# Altium project LCLP_DLog_Revisionado.PrjPcb
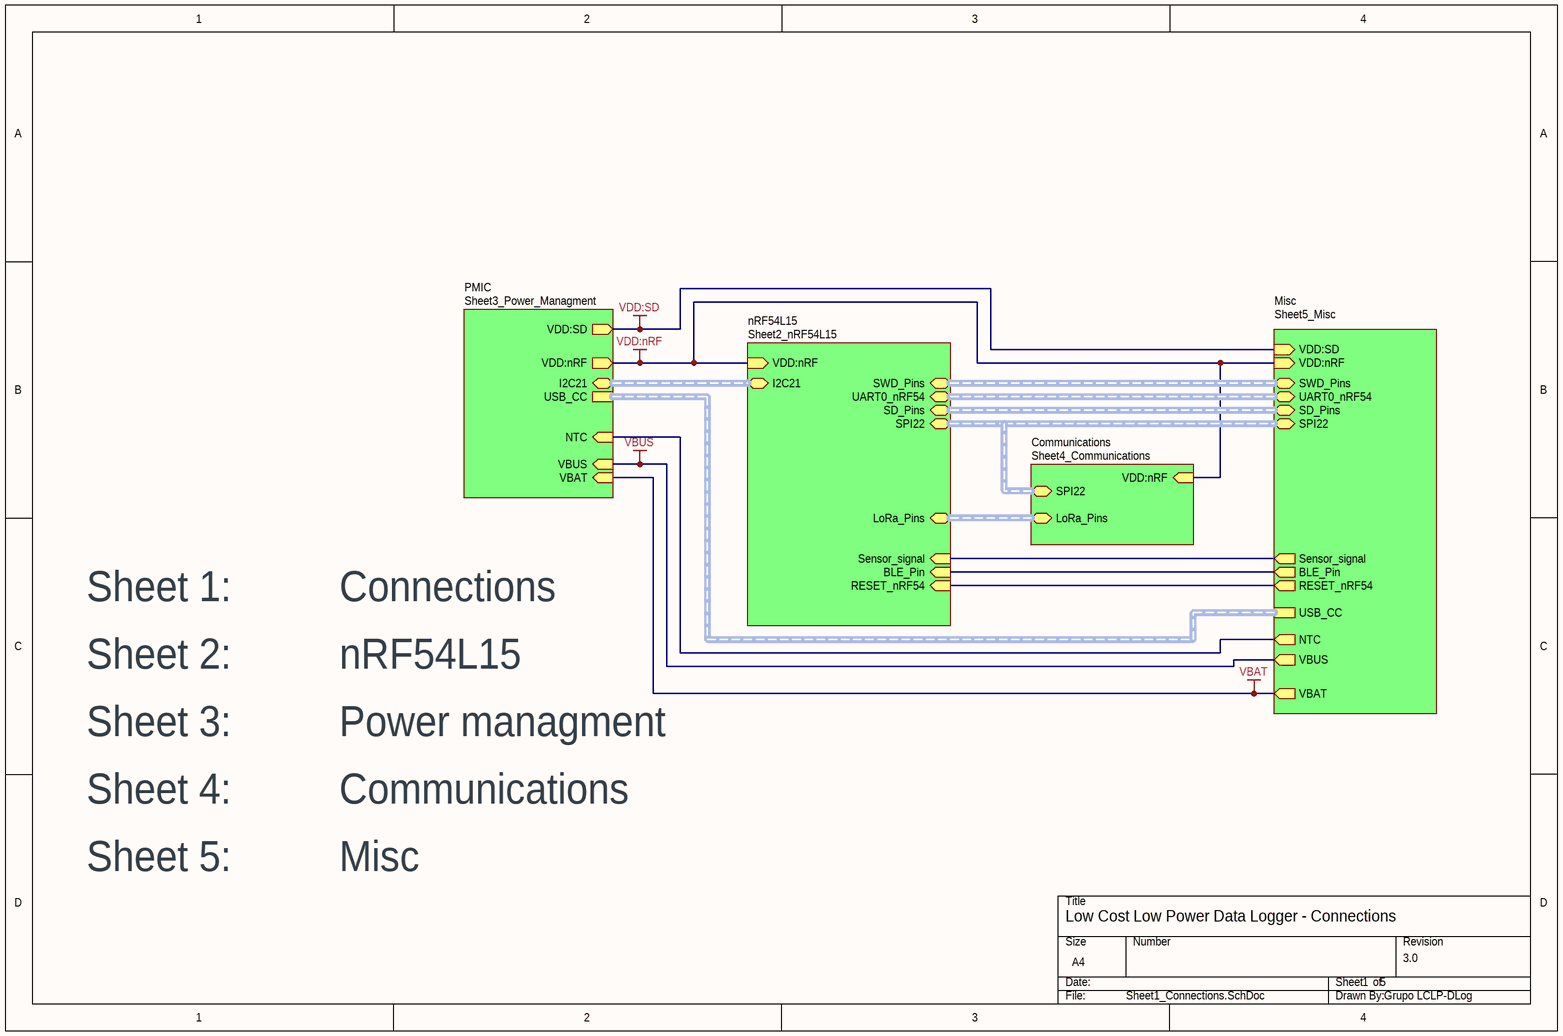
[diagram p0: Sheet1_Connections.SchDoc]
4 sheets, 57 parts. Net scope: hierarchical (ports join the sheet entries above them; power ports are global).
Board file: PCBV2.PcbDoc
Sheets:
  Sheet1_Connections.SchDoc
    nRF54L15 = Sheet2_nRF54L15.SchDoc
    Communications = Sheet4_Communications.SchDoc
    Misc = Sheet5_Misc.SchDoc

## Sheet Sheet1_Connections.SchDoc
size A4; SheetNumber: 1; SheetTotal: 5

### Sub-sheets
Communications = Sheet4_Communications: SPI22 (bidir), LoRa_Pins (bidir), VDD:nRF (in)
Misc = Sheet5_Misc: SWD_Pins (bidir), UART0_nRF54 (bidir), SD_Pins (bidir), RESET_nRF54 (out), SPI22 (bidir), BLE_Pin (out), Sensor_signal (out), USB_CC, NTC (out), VBUS (out), VBAT (out), VDD:nRF (in), VDD:SD (in)
nRF54L15 = Sheet2_nRF54L15: I2C21 (bidir), SPI22 (bidir), LoRa_Pins (bidir), SD_Pins (bidir), UART0_nRF54 (bidir), SWD_Pins (bidir), RESET_nRF54 (in), Sensor_signal (in), BLE_Pin (in), VDD:nRF (in)
PMIC = Sheet3_Power_Managment (file not in this document): I2C21 (bidir), USB_CC, NTC (in), VBUS (in), VBAT (in), VDD:nRF (out), VDD:SD (out)

### Nets
VBAT: sheet PMIC/VBAT, sheet Misc/VBAT
VBUS: sheet PMIC/VBUS, sheet Misc/VBUS
VDD:nRF: sheet nRF54L15/VDD:nRF, sheet PMIC/VDD:nRF, sheet Communications/VDD:nRF, sheet Misc/VDD:nRF
VDD:SD: sheet PMIC/VDD:SD, sheet Misc/VDD:SD
nRF54_RESET: sheet nRF54L15/RESET_nRF54, sheet Misc/RESET_nRF54
P0.04: sheet nRF54L15/Sensor_signal, sheet Misc/Sensor_signal
P1.13: sheet nRF54L15/BLE_Pin, sheet Misc/BLE_Pin
NetP2_2: sheet PMIC/NTC, sheet Misc/NTC

### Buses and harness runs
harness sheet Communications/LoRa_Pins = sheet nRF54L15/LoRa_Pins
harness sheet Communications/SPI22 = sheet Misc/SPI22 = sheet nRF54L15/SPI22
harness sheet Misc/SD_Pins = sheet nRF54L15/SD_Pins
harness sheet Misc/SWD_Pins = sheet nRF54L15/SWD_Pins
harness sheet Misc/UART0_nRF54 = sheet nRF54L15/UART0_nRF54
harness sheet Misc/USB_CC = sheet PMIC/USB_CC
harness sheet nRF54L15/I2C21 = sheet PMIC/I2C21

### Notes on the sheet
- Sheet 1:          Connections
- Sheet 2:          nRF54L15
- Sheet 3:          Power managment
- Sheet 4:          Communications
- Sheet 5:          Misc
- Low Cost Low Power Data Logger - Connections
- 1
- 5
- 3.0
- Grupo LCLP-DLog

## Sheet Sheet2_nRF54L15.SchDoc
size A4; SheetNumber: 2; SheetTotal: 5
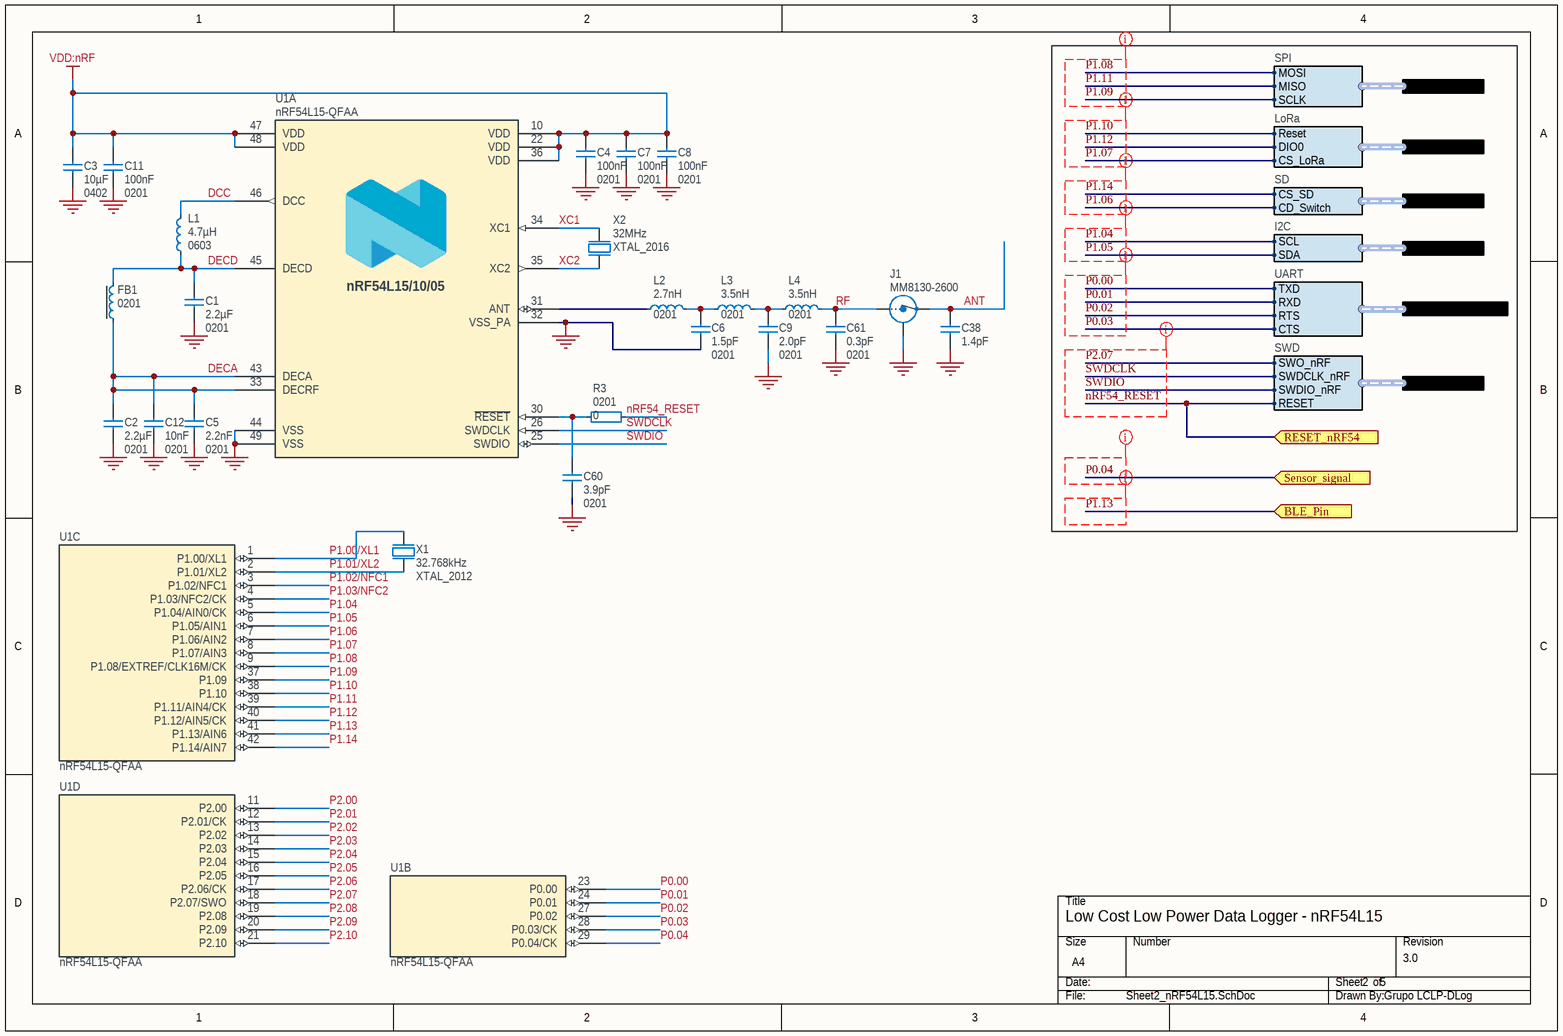
[diagram p1: Sheet2_nRF54L15.SchDoc]

### Parts
C1  2.2µF  Footprint Doc: 0201  [CAPC0603X03L_C]
C2  2.2µF  Footprint Doc: 0201  [CAPC0603X03L_C]
C3  10µF  Footprint Doc: 0402  [CAPC1005X04L]
C4  100nF  Footprint Doc: 0201  [CAPC0603X03L_C]
C5  2.2nF  Footprint Doc: 0201  [CAPC0603X03L_C]
C6  1.5pF  Footprint Doc: 0201  [CAPC0603X03L_C]
C7  100nF  Footprint Doc: 0201  [CAPC0603X03L_C]
C8  100nF  Footprint Doc: 0201  [CAPC0603X03L_C]
C9  2.0pF  Footprint Doc: 0201  [CAPC0603X03L_C]
C11  100nF  Footprint Doc: 0201  [CAPC0603X03L_C]
C12  10nF  Footprint Doc: 0201  [CAPC0603X03L_C]
C38  1.4pF  [CAPC0603X03L_C]
C60  3.9pF  Footprint Doc: 0201  [CAPC0603X03L_C]
C61  0.3pF  Footprint Doc: 0201  [CAPC0603X03L_C]
FB1  Footprint Doc: 0201  [INDC0603X03L_C]  (hidden comment: 120R/0.2A)
J1  MM8130-2600  [COAXIAL-SWF]
L1  4.7µH  Footprint Doc: 0603  [INDC1608X06L]
L2  2.7nH  Footprint Doc: 0201  [INDC0603X03L_C]
L3  3.5nH  Footprint Doc: 0201  [INDC0603X03L_C]
L4  3.5nH  Footprint Doc: 0201  [INDC0603X03L_C]
R3  0  Footprint Doc: 0201  [RESC0603X03L_C]
U1  nRF54L15-QFAA  [QFN40P600X600X90-48N]  (parts A,B,C,D of 4)
X1  32.768kHz  [XTAL_2012]
X2  32MHz  Footprint Doc: XTAL_2016  [BT-XTAL_2016]

### Ports
BLE_Pin (in, see Sheet1_Connections[3C], Sheet5_Misc[1C]), I2C21 (harness I2C, see Sheet1_Connections[2B], Sheet3_Power_Managment[1C]), LoRa_Pins (harness LoRa, see Sheet1_Connections[3C], Sheet4_Communications[1B]), RESET_nRF54 (in, see Sheet1_Connections[3C], Sheet5_Misc[1C]), SD_Pins (harness SD, see Sheet1_Connections[3B], Sheet5_Misc[2B]), Sensor_signal (in, see Sheet1_Connections[3C], Sheet5_Misc[1D]), SPI22 (harness SPI, see Sheet1_Connections[3B], Sheet4_Communications[1B], Sheet5_Misc[2A]), SWD_Pins (harness SWD, see Sheet1_Connections[3B], Sheet5_Misc[3A]), UART0_nRF54 (harness UART, see Sheet1_Connections[3B], Sheet5_Misc[2C])

### Harnesses
SPI: MISO, MOSI, SCLK
LoRa: DIO0, Reset, CS_LoRa
SD: CD_Switch, CS_SD
UART: RXD, TXD, RTS, CTS
I2C: SDA, SCL
SWD: SWDIO_nRF, SWDCLK_nRF, SWO_nRF, RESET

### Nets
GND: C1.1 C2.1 C3.1 C4.2 C5.1 C6.1 C7.2 C8.2 C9.1 C11.2 C12.1 C38.1 C60.1 C61.1 J1.2(Shield) U1.32(VSS_PA) U1.44(VSS) U1.49(VSS) X2.2(GND) X2.4(GND)
VDD:nRF: C3.2 C4.1 C7.1 C8.1 C11.1 U1.10(VDD) U1.22(VDD) U1.36(VDD) U1.47(VDD) U1.48(VDD)
ANT: C38.2 J1.3(OUT)
DCC: L1.1 U1.46(DCC)
DECA: C2.2 C5.2 C12.2 FB1.2 U1.33(DECRF) U1.43(DECA)
DECD: C1.2 FB1.1 L1.2 U1.45(DECD)
nRF54_RESET: R3.2 ; port RESET_nRF54, port SWD_Pins.RESET
P0.00: U1.23(P0.00) ; port UART0_nRF54.TXD
P0.01: U1.24(P0.01) ; port UART0_nRF54.RXD
P0.02: U1.27(P0.02) ; port UART0_nRF54.RTS
P0.03: U1.28(P0.03/CK) ; port UART0_nRF54.CTS
P0.04: U1.29(P0.04/CK) ; port Sensor_signal
P1.00/XL1: U1.1(P1.00/XL1) X1.2(out)
P1.01/XL2: U1.2(P1.01/XL2) X1.1(inp)
P1.02/NFC1: U1.3(P1.02/NFC1)
P1.03/NFC2: U1.4(P1.03/NFC2/CK)
P1.04: U1.5(P1.04/AIN0/CK) ; port I2C21.SCL
P1.05: U1.6(P1.05/AIN1) ; port I2C21.SDA
P1.06: U1.7(P1.06/AIN2) ; port SD_Pins.CD_Switch
P1.07: U1.8(P1.07/AIN3) ; port LoRa_Pins.CS_LoRa
P1.08: U1.9(P1.08/EXTREF/CLK16M/CK) ; port SPI22.MOSI
P1.09: U1.37(P1.09) ; port SPI22.SCLK
P1.10: U1.38(P1.10) ; port LoRa_Pins.Reset
P1.11: U1.39(P1.11/AIN4/CK) ; port SPI22.MISO
P1.12: U1.40(P1.12/AIN5/CK) ; port LoRa_Pins.DIO0  [project net DIO0_LoRa]
P1.13: U1.41(P1.13/AIN6) ; port BLE_Pin
P1.14: U1.42(P1.14/AIN7) ; port SD_Pins.CS_SD
P2.00: U1.11(P2.00)
P2.01: U1.12(P2.01/CK)
P2.02: U1.13(P2.02)
P2.03: U1.14(P2.03)
P2.04: U1.15(P2.04)
P2.05: U1.16(P2.05)
P2.06: U1.17(P2.06/CK)
P2.07: U1.18(P2.07/SWO) ; port SWD_Pins.SWO_nRF
P2.08: U1.19(P2.08)
P2.09: U1.20(P2.09)
P2.10: U1.21(P2.10)
RF: C61.2 J1.1(IN) L4.2
SWDCLK: U1.26(SWDCLK) ; port SWD_Pins.SWDCLK_nRF
SWDIO: U1.25(SWDIO) ; port SWD_Pins.SWDIO_nRF
XC1: U1.34(XC1) X2.1(inp)
XC2: U1.35(XC2) X2.3(out)
NetC6_2: C6.2 L2.2 L3.1
NetC9_2: C9.2 L3.2 L4.1
NetC60_2: C60.2 R3.1 U1.30(~{RESET})
NetL2_1: L2.1 U1.31(ANT)

### Layout directives
net class BUTTONS: nRF54_RESET, P0.00, P0.01, P0.02, P0.03, P0.04, P1.04, P1.05, P1.06, P1.07, P1.08, P1.09, P1.10, P1.11, P1.12, P1.13, P1.14, P2.07, SWDCLK, SWDIO

### Notes on the sheet
- Low Cost Low Power Data Logger - nRF54L15
- 2
- 5
- 3.0
- Grupo LCLP-DLog
- (in symbol nRF54L15-QFAAC00, part A) nRF54L15/10/05

### Library data of the parts
C1 C2 = C0201-2µ2-2.5V-X6T-GRM033D80E225ME47D: Capacitor, Ceramic, 2.2µF 2.5V X6T 0201,±20%; Manufacturer: Murata; Manufacturer Part Number: GRM033R61A225KE47; Part number NEMS: 100200527; Component Status: Active; Pad Count: 2; Note: 2.5V, 20%, X6T; Artikkelnr Noca: N.A.; Part Number: C0201-2µ2-2.5V-X6T-GRM033D80E225ME47D; Component Class: Capacitors; Author: stl1; ComponentLink1URL: https://www.murata.com/products/productdetail?partno=GRM033D80E225ME47%23; ComponentLink1Description: Datasheet; ComponentLink2URL: N.A.; ComponentLink2Description: Supplier link; HelpURL: N.A.; LatestRevisionDate: 2022-02-27; Published: 2022-02-27; Value: 2.2µF; Supplier 1: Mouser; Supplier Part Number 1: 81-GRM033D80E225ME7D; Supplier 2: Digi-Key; Supplier Part Number 2: 490-18653-1-ND; Part number IPS: N.A.; Part number Norautron: N.A.; PartId: 100200527
C3 = C0402-10µF-6.3V-X6S: Capacitor, X6S, ±20%, 6.3V; Manufacturer: N.A.; Part number NEMS: 100200478; Component Status: Active; Pad Count: 2; Part Number: C0402-10µF-6.3V-X6S; PartId: 100200478; Component Class: Capacitors; Author: getr; Manufacturer Part Number: N.A.; ComponentLink1URL: N.A.; ComponentLink1Description: Datasheet; ComponentLink2URL: N.A.; ComponentLink2Description: Supplier link; HelpURL: N.A.; LatestRevisionDate: 2021-06-25; Published: 2021-06-25; Value: 10µF; Note: 6.3V; Supplier 1: N.A.; Supplier Part Number 1: N.A.; Supplier 2: N.A.; Supplier Part Number 2: N.A.; Artikkelnr Noca: N.A.; Part number IPS: N.A.; Part number Norautron: N.A.
C4 C7 C8 C11 = C0201-100n-10V-X7R: Capacitor, X7R, ±10%; Manufacturer: N.A.; Part number NEMS: 100200469; Note: 10V; Pad Count: 2; Component Status: Active; Part Number: C0201-100n-10V-X7R; Manufacturer Part Number: N.A.; LatestRevisionDate: 2021-04-12; Published: 2021-04-12; Value: 100nF; Artikkelnr Noca: N.A.; Part number IPS: N.A.; ComponentLink1URL: N.A.; ComponentLink1Description: Datasheet; ComponentLink2URL: N.A.; ComponentLink2Description: Supplier link; HelpURL: N.A.; Supplier 1: N.A.; Supplier Part Number 1: N.A.; Supplier 2: N.A.; Supplier Part Number 2: N.A.; Component Class: Capacitors; Author: getr; Part number Norautron: N.A.; PartId: 100200469
C5 = C0201-2n2: Capacitor, X7R, ±10%, 10V; Manufacturer: N.A.; Part number IPS: 00000001778; Part number Norautron: 26470002; Part number NEMS: 100200060; Component Status: Active; Pad Count: 2; Part Number: C0201-2n2; PartId: 100200060; Component Class: Capacitors; Author: rsk; Manufacturer Part Number: N.A.; ComponentLink1URL: N.A.; ComponentLink1Description: Datasheet; ComponentLink2URL: N.A.; ComponentLink2Description: Supplier link; HelpURL: N.A.; LatestRevisionDate: 2014-11-13; Published: 2014-11-13; Value: 2.2nF; Note: 10V; Supplier 1: N.A.; Supplier Part Number 1: N.A.; Supplier 2: N.A.; Supplier Part Number 2: N.A.; Artikkelnr Noca: N.A.
C6 = C0201-1.5p-25V-NP0-GJM0335C1E1R5WB01: Capacitor, NP0, ±0.05pF, 25V, High Q; Manufacturer: Murata; Part number NEMS: 100200477; Component Status: Active; Pad Count: 2; Artikkelnr Noca: N.A.; Part Number: C0201-1.5p-25V-NP0-GJM0335C1E1R5WB01; PartId: 100200477; Component Class: Capacitors; Author: masi; Manufacturer Part Number: GJM0335C1E1R5WB01; ComponentLink1URL: https://search.murata.co.jp/Ceramy/image/img/A01X/G101/ENG/GJM0335C1E1R5WB01-01.pdf; ComponentLink1Description: Datasheet; ComponentLink2URL: N.A.; ComponentLink2Description: Supplier link; HelpURL: https://www.murata.com/products/productdetail?partno=GJM0335C1E1R5WB01%23; LatestRevisionDate: 2021-06-15; Published: 2021-06-15; Value: 1.5pF; Note: 25V; Supplier 1: Digi-Key; Supplier Part Number 1: 490-11176-2-ND; Supplier 2: Mouser; Supplier Part Number 2: 81-GJM0335C1E1R5WB1D; Part number IPS: N.A.; Part number Norautron: N.A.
C9 = C0201-2.0p-HQ-Murata: Capacitor, NP0, ±0.05pF, 25V; Manufacturer: Murata; Manufacturer Part Number: GJM0335C1E2R0WB01; Part number IPS: 00000001775; Part number NEMS: 100200419; Component Status: Active; Pad Count: 2; Artikkelnr Noca: N.A.; Part Number: C0201-2.0p-HQ-Murata; PartId: 100200419; Component Class: Capacitors; Author: rsk; ComponentLink1URL: N.A.; ComponentLink1Description: Datasheet; ComponentLink2URL: N.A.; ComponentLink2Description: Supplier link; HelpURL: https://psearch.en.murata.com/capacitor/product/GJM0335C1E2R0WB01%23.html; LatestRevisionDate: 2018-10-25; Published: 2018-10-25; Value: 2.0pF; Note: 25V; Supplier 1: N.A.; Supplier Part Number 1: N.A.; Supplier 2: N.A.; Supplier Part Number 2: N.A.; Part number Norautron: N.A.
C12 = C0201-10n-6.3V-X7R: Capacitor, X7R, 6.3V; Manufacturer: Murata; Manufacturer Part Number: GRM033R70J103KA01D; Part number NEMS: 100200407; Component Status: Active; Pad Count: 2; Artikkelnr Noca: N.A.; Part Number: C0201-10n-6.3V-X7R; PartId: 100200407; Component Class: Capacitors; Author: rsk; ComponentLink1URL: http://search.murata.co.jp/Ceramy/image/img/A01X/G101/ENG/GRM033R70J103KA01-01.pdf; ComponentLink1Description: Datasheet; ComponentLink2URL: N.A.; ComponentLink2Description: Supplier link; HelpURL: N.A.; LatestRevisionDate: 2020-10-13; Published: 2018-05-07; Value: 10nF; Note: 6.3V; Supplier 1: Digi-Key; Supplier Part Number 1: 490-1262-1-ND; Supplier 2: N.A.; Supplier Part Number 2: N.A.; Part number IPS: N.A.; Part number Norautron: N.A.
C38 = C0201-1.4p-25V-GJM0335C1E1R4WB01D: Capacitor, C0G, ±0.05pF, 25V; Manufacturer: Murata; Part number NEMS: 100200553; Pad Count: 2; Artikkelnr Noca: N.A.; Component Status: Active; Part Number: C0201-1.4p-25V-GJM0335C1E1R4WB01D; PartId: 100200553; Component Class: Capacitors; Author: stl1; Manufacturer Part Number: GJM0335C1E1R4WB01D; ComponentLink1URL: https://www.murata.com/products/productdetail?partno=GJM0335C1E1R4WB01%23; ComponentLink1Description: Datasheet; ComponentLink2URL: N.A.; ComponentLink2Description: Supplier link; HelpURL: N.A.; Footprint Doc: 0201; LatestRevisionDate: 2023-05-30; Published: 2023-05-30; Value: 1.4pF; Note: 25V; Supplier 1: Digi-Key; Supplier Part Number 1: 490-GJM0335C1E1R4WB01DTR-ND; Supplier 2: Mouser; Supplier Part Number 2: 81-GJM0335C1E1R4WB1D; Part number IPS: N.A.; Part number Norautron: N.A.
C60 = C0201-3.9p: Chip Cap 0201; Manufacturer: N.A.; Part number NEMS: 100200024; Component Status: Active; Pad Count: 2; Note: Chip Cap 1%; Part Number: C0201-3.9p; PartId: 100200024; Component Class: Capacitors; Author: rsk; Manufacturer Part Number: N.A.; ComponentLink1URL: N.A.; ComponentLink1Description: Datasheet; ComponentLink2URL: N.A.; ComponentLink2Description: Supplier link; HelpURL: N.A.; LatestRevisionDate: 2014-11-13; Published: 2014-11-13; Value: 3.9pF; Supplier 1: N.A.; Supplier Part Number 1: N.A.; Supplier 2: N.A.; Supplier Part Number 2: N.A.; Artikkelnr Noca: N.A.; Part number IPS: N.A.; Part number Norautron: N.A.
C61 = C0201-0.3p-50V-GRM0335C1HR30BA01: Capacitor, C0G, ±0.1pF, 50V; Manufacturer: Murata; Part number NEMS: 100200650; Component Status: Active; Pad Count: 2; Artikkelnr Noca: N.A.; Part Number: C0201-0.3p-50V-GRM0335C1HR30BA01; PartId: 100200650; Component Class: Capacitors; Author: masi; Manufacturer Part Number: GRM0335C1HR30BA01; ComponentLink1URL: https://www.murata.com/en-global/products/productdetail?partno=GRM0335C1HR30BA01%23; ComponentLink1Description: Datasheet; ComponentLink2URL: N.A.; ComponentLink2Description: Supplier link; HelpURL: N.A.; LatestRevisionDate: 2024-01-10; Published: 2024-01-10; Value: 0.3pF; Note: 50V; Supplier 1: Digi-Key; Supplier Part Number 1: 490-6135-2-ND; Supplier 2: Mouser; Supplier Part Number 2: 81-GRM0335C1HR30BA1D; Part number IPS: N.A.; Part number Norautron: N.A.
FB1 = FB0201-120R@100M-200mA-BLM03AG121SN1D: Ferrite Bead, 120 Ohm @ 100MHz, 200mA, 500 mOhm Max; Manufacturer: Murata; Part number NEMS: 100300419; Component Status: Active; Pad Count: 2; Artikkelnr Noca: N.A.; Part Number: FB0201-120R@100M-200mA-BLM03AG121SN1D; Component Class: Inductors; Author: stl1; Manufacturer Part Number: BLM03AG121SN1D; ComponentLink1URL: https://www.murata.com/en-eu/products/productdetail?partno=BLM03AG121SN1%23; ComponentLink1Description: Datasheet; ComponentLink2URL: N.A.; ComponentLink2Description: Supplier link; HelpURL: N.A.; LatestRevisionDate: 2022-02-27; Published: 2022-02-27; Value: 120R/0.2A; Note: Ferrite Bead; Supplier 1: Digi-Key; Supplier Part Number 1: 490-5622-1-ND; Supplier 2: Mouser; Supplier Part Number 2: 81-BLM03AX121SN1D; Part number IPS: N.A.; Part number Norautron: N.A.; PartId: 100300419
J1 = MM8130-2600: Coaxial Connector with Switch; Manufacturer: Murata; Part number IPS: 00000009955; Part number Norautron: 26030338; Part number NEMS: 100500400; Component Status: Active; Pad Count: 3; Note: N.A.; Artikkelnr Noca: 55029011; Part Number: MM8130-2600; PartId: 100500400; Component Class: Connectors; Author: rsk; Manufacturer Part Number: MM8130-2600; ComponentLink1URL: N.A.; ComponentLink1Description: Datasheet; ComponentLink2URL: N.A.; ComponentLink2Description: Supplier link; HelpURL: http://www.murata.com/products/catalog/pdf/o33e.pdf; LatestRevisionDate: 2014-04-24; Published: 2014-04-24; Footprint Doc: COAXIAL-SWF; Value: MM8130-2600; Supplier 1: Digi-Key; Supplier Part Number 1: 490-4981-1-ND; Supplier 2: Mouser; Supplier Part Number 2: 81-MM8130-2600RA2; System: Connector
L1 = L0603-4µ7-MLZ1608M4R7WT000: Inductor, 120mA, ±20%, 0.65R; Manufacturer: TDK Corporation; Part number NEMS: 100300440; Component Status: Active; Pad Count: 2; Note: Power Inductor ±20%; Artikkelnr Noca: N.A.; Part Number: L0603-4µ7-MLZ1608M4R7WT000; PartId: 100300440; Component Class: Inductors; Author: stl1; Manufacturer Part Number: MLZ1608M4R7WT000; ComponentLink1URL: https://product.tdk.com/en/search/inductor/inductor/smd/info?part_no=MLZ1608M4R7WT000; ComponentLink1Description: Datasheet; ComponentLink2URL: N.A.; ComponentLink2Description: Supplier link; HelpURL: N.A.; LatestRevisionDate: 2023-05-10; Published: 2023-05-10; Value: 4.7µH; Supplier 1: Digi-Key; Supplier Part Number 1: 445-6390-2-ND; Supplier 2: Mouser; Supplier Part Number 2: 810-MLZ1608M4R7WT000; Part number IPS: N.A.; Part number Norautron: N.A.
L2 = L0201-2n7-HQ-Murata: Inductor, 600mA, ±0.1ｎH, 120mOhm; Manufacturer: Murata; Manufacturer Part Number: LQP03HQ2N7B02; Part number IPS: 00000001753; Part number NEMS: 100300214; Component Status: Active; Pad Count: 2; Note: -55°C ~ 125°C; Artikkelnr Noca: N.A.; Part Number: L0201-2n7-HQ-Murata; PartId: 100300214; Component Class: Inductors; Author: rsk; ComponentLink1URL: https://search.murata.co.jp/Ceramy/image/img/P02/JELF243C-0021.pdf; ComponentLink1Description: Datasheet; ComponentLink2URL: N.A.; ComponentLink2Description: Supplier link; HelpURL: https://psearch.en.murata.com/inductor/product/LQP03HQ2N7B02%23.html; LatestRevisionDate: 2018-10-23; Published: 2018-10-23; Value: 2.7nH; Supplier 1: Digi-Key; Supplier Part Number 1: 490-13909-1-ND; Supplier 2: N.A.; Supplier Part Number 2: N.A.; Part number Norautron: N.A.
L3 L4 = L0201-3n5-HQ-Murata: Inductor, 500mA, ±0.1ｎH, 170mOhm; Manufacturer: Murata; Manufacturer Part Number: LQP03HQ3N5B02; Part number NEMS: 100300222; Component Status: Active; Pad Count: 2; Note: -55°C ~ 125°C; Artikkelnr Noca: N.A.; Part Number: L0201-3n5-HQ-Murata; PartId: 100300222; Component Class: Inductors; Author: rsk; ComponentLink1URL: https://search.murata.co.jp/Ceramy/image/img/P02/JELF243C-0021.pdf; ComponentLink1Description: Datasheet; ComponentLink2URL: N.A.; ComponentLink2Description: Supplier link; HelpURL: https://psearch.en.murata.com/inductor/product/LQP03HQ3N5B02%23.html; LatestRevisionDate: 2018-10-23; Published: 2018-10-23; Value: 3.5nH; Supplier 1: Digi-Key; Supplier Part Number 1: 490-13925-1-ND; Supplier 2: N.A.; Supplier Part Number 2: N.A.; Part number IPS: N.A.; Part number Norautron: N.A.
R3 = R0201-1k0: Resistor, ±1%, 0.05W; Manufacturer: N.A.; Part number IPS: 00000005786; Part number NEMS: 100100043; Component Status: Active; Pad Count: 2; Value: 1k; Note: Chip Res 1%; Part Number: R0201-1k0; PartId: 100100043; Component Class: Resistors; Author: rsk; Manufacturer Part Number: N.A.; ComponentLink1URL: N.A.; ComponentLink1Description: Datasheet; ComponentLink2URL: N.A.; ComponentLink2Description: Supplier link; HelpURL: N.A.; LatestRevisionDate: 2014-11-13; Published: 2014-11-13; Supplier 1: N.A.; Supplier Part Number 1: N.A.; Supplier 2: N.A.; Supplier Part Number 2: N.A.; Artikkelnr Noca: N.A.; Part number Norautron: N.A.
U1 = nRF54L15-QFAAC00: Multi-protocol Bluetooth Low Energy, IEEE 802.15.4 and 2.4GHz proprietary Wireless MCU; Manufacturer: Nordic Semiconductor; Part number NEMS: 102000382; Component Status: Active; Pad Count: 49; Note: N.A.; Part Number: nRF54L15-QFAAC00; Component Class: Nordic_Devices; Author: stl1; Manufacturer Part Number: nRF54L15-QFAAC00; ComponentLink1URL: N.A.; ComponentLink1Description: Datasheet; ComponentLink2URL: N.A.; ComponentLink2Description: Supplier link; HelpURL: N.A.; LatestRevisionDate: 2025-01-30; Published: 2025-01-30; Footprint Doc: QFN-48; Value: nRF54L15-QFAA; Supplier 1: Nordic Semiconductor; Supplier Part Number 1: nRF54L15-QFAAC00; Supplier 2: N.A.; Supplier Part Number 2: N.A.; Artikkelnr Noca: N.A.; Part number IPS: N.A.; Part number Norautron: N.A.; PartId: 102000382
X1 = XTAL_SMD2012_32.768kHz_9pF_TXC: XTAL SMD 2012, 32.768kHz, 9pF, ±20ppm; Manufacturer: TXC Corporation; Manufacturer Part Number: 9HT11-32.768KDZC-T; Part number NEMS: 101600107; Component Status: Active; Pad Count: 2; Note: XTAL SMD 32.768kHz; Artikkelnr Noca: N.A.; Part Number: XTAL_SMD2012_32.768kHz_9pF_TXC; PartId: 101600107; Component Class: Oscillators; Author: eisk; ComponentLink1URL: http://www.txccrystal.com/images/pdf/9ht11.pdf; ComponentLink1Description: Datasheet; ComponentLink2URL: https://www.digikey.com/en/products/detail/9HT11-32.768KDZC-T/887-1426-1-ND/2403277; ComponentLink2Description: Supplier link; HelpURL: http://www.txccrystal.com/images/pdf/9ht11.pdf; LatestRevisionDate: 2023-03-14; Published: 2014-03-28; Footprint Doc: XTAL_2012; Value: 32.768kHz; Supplier 1: Digi-Key; Supplier Part Number 1: 887-1426-2-ND; Supplier 2: Mouser; Supplier Part Number 2: 717-9HT11-32.7KDZC-T; Part number IPS: N.A.; Part number Norautron: N.A.
X2 = XTAL_SMD2016_32MHz_8pF_Kyocera: XTAL SMD 2016, 32MHz, Cl=8pF, Tot: ±40ppm; Manufacturer Part Number: CX2016DB32000D0WZRC1; Part number IPS: 00000007827; Part number Norautron: 26511136; Part number NEMS: 101600039; Component Status: Active; Pad Count: 4; Note: XTAL SMD 32.000MHz; Artikkelnr Noca: 22010022; Part Number: XTAL_SMD2016_32MHz_8pF_Kyocera; PartId: 101600039; Component Class: Oscillators; Author: rsk; Manufacturer: Kyocera; ComponentLink1URL: N.A.; ComponentLink1Description: Datasheet; ComponentLink2URL: N.A.; ComponentLink2Description: Supplier link; HelpURL: http://media.digikey.com/pdf/Data%20Sheets/AVX%20PDFs/CX2016DB32000D0WZRC1_Spec.pdf; LatestRevisionDate: 2016-06-02; Published: 2015-10-15; Value: 32MHz; Supplier 1: Digi-Key; Supplier Part Number 1: 1253-1586-1-ND; Supplier 2: N.A.; Supplier Part Number 2: N.A.

## Sheet Sheet4_Communications.SchDoc
size A4; SheetNumber: 4; SheetTotal: 5
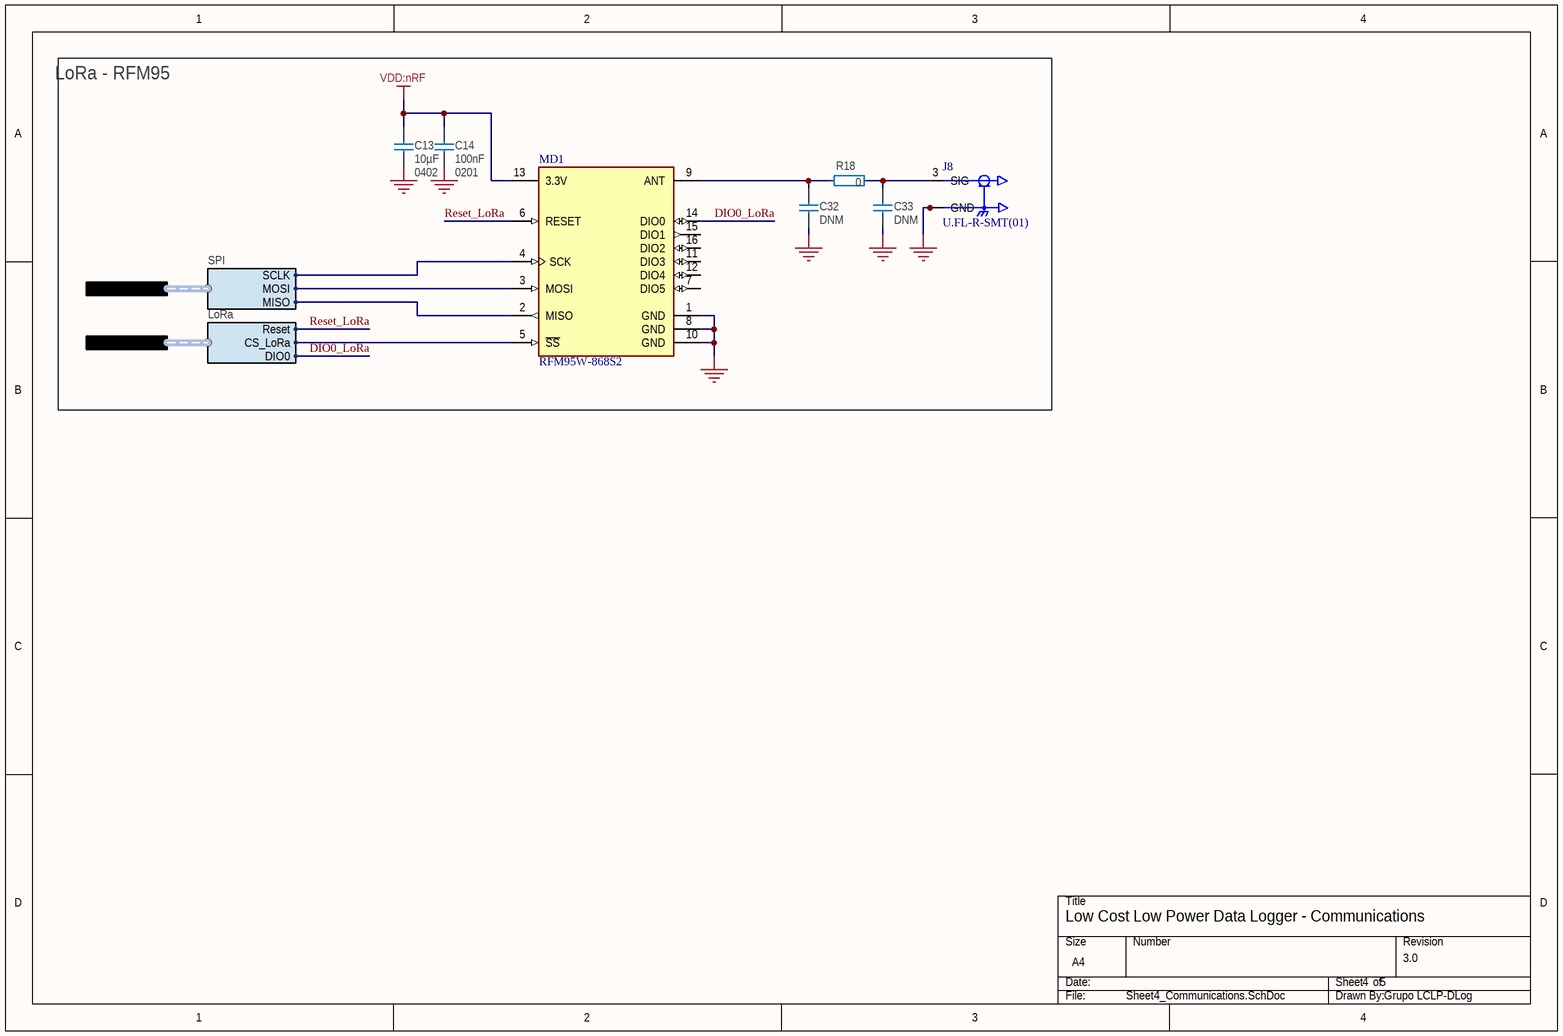
[diagram p2: Sheet4_Communications.SchDoc]

### Parts
C13  10µF  Footprint Doc: 0402  [CAPC1005X04L]
C14  100nF  Footprint Doc: 0201  [CAPC0603X03L_C]
C32  DNM  [CAPC1005X04L_DNM]
C33  DNM  [CAPC1005X04L_DNM]
J8  U.FL-R-SMT(01)  [HRS_U.FL-R-SMT(01)]
MD1  RFM95W-868S2  [FP-RFM95W-868S2-MFG]
R18  0  [RESC1005X04L]

### Blocks framed on the sheet
LoRa - RFM95: C13 C14 C32 C33 J8 MD1 R18

### Ports
LoRa_Pins (harness LoRa, see Sheet1_Connections[3C], Sheet2_nRF54L15[4A]), SPI22 (harness SPI, see Sheet1_Connections[3B], Sheet2_nRF54L15[4A], Sheet5_Misc[2A])

### Harnesses
SPI: MISO, MOSI, SCLK
LoRa: DIO0, Reset, CS_LoRa

### Nets
GND: C13.1 C14.2 C32.1 C33.1 J8.1(GND) J8.2(GND) MD1.1(GND) MD1.8(GND) MD1.10(GND)
VDD:nRF: C13.2 C14.1 MD1.13(3.3V)
DIO0_LoRa: MD1.14(DIO0) ; port LoRa_Pins.DIO0
P1.07: MD1.5(~{SS}) ; port LoRa_Pins.CS_LoRa
P1.08: MD1.3(MOSI) ; port SPI22.MOSI
P1.09: MD1.4(SCK) ; port SPI22.SCLK
P1.11: MD1.2(MISO) ; port SPI22.MISO
Reset_LoRa: MD1.6(RESET) ; port LoRa_Pins.Reset  [project net P1.10]
NetC32_2: C32.2 MD1.9(ANT) R18.2
NetC33_2: C33.2 J8.3(SIG) R18.1

Not connected (* = marked no-connect by the designer): MD1 7(DIO5) 11(DIO3) 12(DIO4) 15(DIO1) 16(DIO2)

### Notes on the sheet
- Low Cost Low Power Data Logger - Communications
- 4
- 5
- 3.0
- Grupo LCLP-DLog

### Library data of the parts
C13 = C0402-10µF-6.3V-X6S: as C3 on sheet Sheet2_nRF54L15; Part Number: C0402-10µF-6.3V-X6S; PartId: 100200478; Component Class: Capacitors; Author: getr; Manufacturer Part Number: N.A.; ComponentLink1URL: N.A.; ComponentLink1Description: Datasheet; ComponentLink2URL: N.A.; ComponentLink2Description: Supplier link; HelpURL: N.A.; LatestRevisionDate: 2021-06-25; Published: 2021-06-25; Value: 10µF; Note: 6.3V; Supplier 1: N.A.; Supplier Part Number 1: N.A.; Supplier 2: N.A.; Supplier Part Number 2: N.A.; Artikkelnr Noca: N.A.; Part number IPS: N.A.; Part number Norautron: N.A.
C14 = C0201-100n-10V-X7R: as C4 on sheet Sheet2_nRF54L15; Part Number: C0201-100n-10V-X7R; Manufacturer Part Number: N.A.; LatestRevisionDate: 2021-04-12; Published: 2021-04-12; Value: 100nF; Artikkelnr Noca: N.A.; Part number IPS: N.A.; ComponentLink1URL: N.A.; ComponentLink1Description: Datasheet; ComponentLink2URL: N.A.; ComponentLink2Description: Supplier link; HelpURL: N.A.; Supplier 1: N.A.; Supplier Part Number 1: N.A.; Supplier 2: N.A.; Supplier Part Number 2: N.A.; Component Class: Capacitors; Author: getr; Part number Norautron: N.A.; PartId: 100200469
C32 C33 = C0402-2µ2-10V: Capacitor, X5R, ±10%; Manufacturer: N.A.; Part number NEMS: 100200376; Component Status: Active; Pad Count: 2; Value: 2.2µF; Note: 10V; Part Number: C0402-2µ2-10V; PartId: 100200376; Component Class: Capacitors; Author: rsk; Manufacturer Part Number: N.A.; ComponentLink1URL: N.A.; ComponentLink1Description: Datasheet; ComponentLink2URL: N.A.; ComponentLink2Description: Supplier link; HelpURL: N.A.; LatestRevisionDate: 2020-10-13; Published: 2016-08-22; Footprint Doc: 0402; Supplier 1: Digi-Key; Supplier Part Number 1: 490-10451-1-ND; Supplier 2: N.A.; Supplier Part Number 2: N.A.; Artikkelnr Noca: N.A.; Part number IPS: N.A.; Part number Norautron: N.A.
J8 = CMP-002-00098-1: U.FL (UMCC) Connector Receptacle, Male Pin 50Ohm Surface Mount Solder. RF Connectors / Coaxial Connectors; MF: Hirose; Purchase-URL: https://pricing.snapeda.com/search/part/U.FL-R-SMT(01)/?ref=eda; Pins: 3; Check_prices: https://www.snapeda.com/parts/U.FL-R-SMT(01)/Hirose+Electric+Co+Ltd/view-part/?ref=eda; Case/Package: None; Design Item ID: U.FL-R-SMT(01); Price: None; Value: *; Component Type: Standard; Availability: In Stock; Source: U.FL-R-SMT(01).SchLib; MP: U.FL-R-SMT(01); SnapEDA_Link: https://www.snapeda.com/parts/U.FL-R-SMT(01)/Hirose+Electric+Co+Ltd/view-part/?ref=snap
MD1 = CMP-00000-1: RFM95W LoRA Transceiver Module 868MHz; Sensitivity (dBm): -123dBm; Min Supply Voltage: 1.8V; Max Junction Temperature (Tj): 125°C; Number of GPIO: 6; Interface: SPI; Data Rate: 300kbps; Nominal Supply Current: 5.8mA; Max Supply Voltage: 3.7V; Current - Receiving: 13.8mA; Current - Transmitting: 120mA; Frequency: 868MHz; Case/Package: SMD/SMT; Height: 1.8mm; Min Operating Temperature: -20°C; Mounting Technology: Surface Mount; Clock Frequency: 868MHz; RoHS: Compliant; Max Operating Temperature: 70°C
R18 = R0201-1k0: as R3 on sheet Sheet2_nRF54L15; Part Number: R0201-1k0; PartId: 100100043; Component Class: Resistors; Author: rsk; Manufacturer Part Number: N.A.; ComponentLink1URL: N.A.; ComponentLink1Description: Datasheet; ComponentLink2URL: N.A.; ComponentLink2Description: Supplier link; HelpURL: N.A.; LatestRevisionDate: 2014-11-13; Published: 2014-11-13; Supplier 1: N.A.; Supplier Part Number 1: N.A.; Supplier 2: N.A.; Supplier Part Number 2: N.A.; Artikkelnr Noca: N.A.; Part number Norautron: N.A.

## Sheet Sheet5_Misc.SchDoc
size A4; SheetNumber: 5; SheetTotal: 5
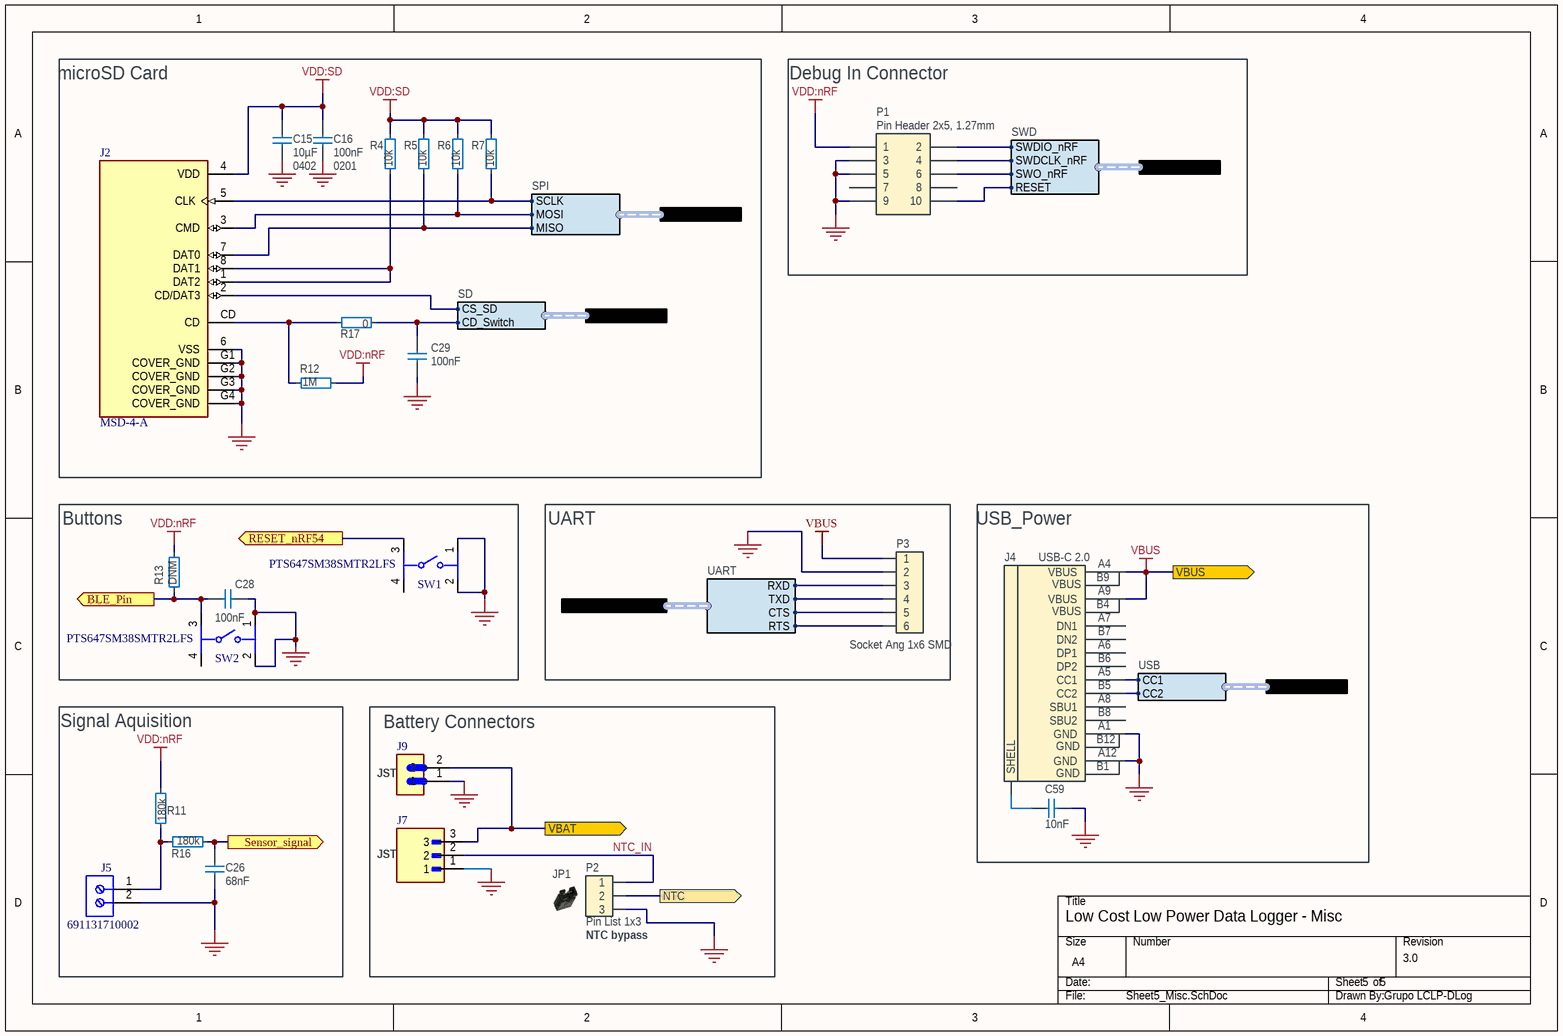
[diagram p3: Sheet5_Misc.SchDoc]

### Parts
C15  10µF  Footprint Doc: 0402  [CAPC1005X04L]
C16  100nF  Footprint Doc: 0201  [CAPC0603X03L_C]
C26  68nF  [CAPC1608X06L]
C28  100nF  [CAPC1608X06L]
C29  100nF  [CAPC1608X06L]
C59  10nF  [CAPC1608X06L]
J2  MSD-4-A  [CUI_MSD-4-A]
J4  USB-C 2.0  [SD-80259-001]
J5  691131710002  [691131710002]
J7  S3B-ZR-SM4A-TF  [JST_S3B-ZR-SM4A-TF]  (value not drawn)
J9  S2B-ZR-SM4A-TF  [JST_S2B-ZR-SM4A-TF]  (value not drawn)
JP1  Shunt 2.54mm  [Shunt_2.54mm_Vertical]  (value not drawn)
P1  Pin Header 2x5, 1.27mm  [HDR_2x5-SMD-1.27mm-K]
P2  Pin List 1x3  [LIST_1x3_SMD]
P3  Socket Ang 1x6 SMD  [SOCKET_1x6_SMD-ANG]
R4  10k  [RESC0603X03L_C]
R5  10k  [RESC0603X03L_C]
R6  10k  [RESC0603X03L_C]
R7  10k  [RESC0603X03L_C]
R11  180k  [RESC1005X04L]
R12  1M  [RESC1005X04L]
R13  DNM  [RESC1005X04L_NC]
R16  180k  [RESC1005X04L]
R17  0  [RESC1005X04L]
SW1  PTS647SM38SMTR2LFS  [FP-PTS647SM38SMTR2LFS-MFG]
SW2  PTS647SM38SMTR2LFS  [FP-PTS647SM38SMTR2LFS-MFG]

### Blocks framed on the sheet
microSD Card: C15 C16 C29 J2 R4-R7 R12 R17
Debug In Connector: P1
Buttons: C28 R13 SW1 SW2
UART: P3
USB_Power: C59 J4
Signal Aquisition: C26 J5 R11 R16
Battery Connectors: J7 J9 JP1 P2

### Ports
BLE_Pin (out, see Sheet1_Connections[4C], Sheet2_nRF54L15[4B]), NTC (out, see Sheet1_Connections[4C], Sheet3_Power_Managment[1B]), RESET_nRF54 (out, see Sheet1_Connections[4C], Sheet2_nRF54L15[4B]), SD_Pins (harness SD, see Sheet1_Connections[4B], Sheet2_nRF54L15[4A]), Sensor_signal (out, see Sheet1_Connections[4C], Sheet2_nRF54L15[4B]), SPI22 (harness SPI, see Sheet1_Connections[4B], Sheet2_nRF54L15[4A], Sheet4_Communications[1B]), SWD_Pins (harness SWD, see Sheet1_Connections[4B], Sheet2_nRF54L15[4B]), UART0_nRF54 (harness UART, see Sheet1_Connections[4B], Sheet2_nRF54L15[4B]), USB_CC (harness USB, see Sheet1_Connections[4C], Sheet3_Power_Managment[1A]), VBAT (out, see Sheet1_Connections[4C], Sheet3_Power_Managment[1B]), VBUS (out, see Sheet1_Connections[4C], Sheet3_Power_Managment[1A])

### Harnesses
SD: CS_SD, CD_Switch
UART: RXD, TXD, RTS, CTS
SPI: MISO, MOSI, SCLK
SWD: SWDIO_nRF, SWDCLK_nRF, SWO_nRF, RESET
USB: CC2, CC1

### Nets
GND: C15.1 C16.2 C26.1 C28.1 C29.1 C59.2 J2.6(VSS) J2.G1(COVER_GND) J2.G2(COVER_GND) J2.G3(COVER_GND) J2.G4(COVER_GND) J4.A1(GND) J4.A12(GND) J5.2 J7.1 J9.1 P1.3 P1.5 P1.9 P2.3 P3.2 SW1.1 SW1.2 SW2.1 SW2.2
VBAT: J7.3 J9.2 ; port VBAT
VBUS: J4.A4(VBUS) J4.A9(VBUS) P3.1 ; port VBUS
VDD:nRF: P1.1 R11.2 R12.2 R13.2
VDD:SD: C15.2 C16.1 J2.4(VDD) R4.1 R5.1 R6.1 R7.1
nRF54_RESET: P1.10 SW1.3 ; port RESET_nRF54, port SWD_Pins.RESET
NTC_IN: J7.2 P2.1
P0.00: P3.4 ; port UART0_nRF54.TXD
P0.01: P3.3 ; port UART0_nRF54.RXD
P0.02: P3.6 ; port UART0_nRF54.RTS
P0.03: P3.5 ; port UART0_nRF54.CTS
P0.04: C26.2 R16.1 ; port Sensor_signal
P1.06: C29.2 R17.1 ; port SD_Pins.CD_Switch
P1.08: J2.3(CMD) R6.2 ; port SPI22.MOSI
P1.09: J2.5(CLK) R7.2 ; port SPI22.SCLK
P1.11: J2.7(DAT0) R5.2 ; port SPI22.MISO
P1.13: C28.2 R13.1 SW2.3 ; port BLE_Pin
P1.14: J2.2(CD/DAT3) ; port SD_Pins.CS_SD
P2.07: P1.6 ; port SWD_Pins.SWO_nRF
SWDCLK: P1.4 ; port SWD_Pins.SWDCLK_nRF
SWDIO: P1.2 ; port SWD_Pins.SWDIO_nRF
NetC59_1: C59.1 J4.SHLD(SHELL)
NetJ2_1: J2.1(DAT2) J2.8(DAT1) R4.2
NetJ2_CD: J2.CD R12.1 R17.2
NetJ4_A5: J4.A5(CC1) ; port USB_CC.CC1
NetJ4_B5: J4.B5(CC2) ; port USB_CC.CC2
NetJ5_1: J5.1 R11.1 R16.2
NetP2_2: P2.2 ; port NTC

Not connected (* = marked no-connect by the designer): J4 A6(DP1) A7(DN1) A8(SBU1) B6(DP2) B7(DN2) B8(SBU2); P1 7 8; SW1 4; SW2 4

### Notes on the sheet
- (near J9) JST
- (near J7) JST
- Low Cost Low Power Data Logger - Misc
- (near P2) NTC bypass
- 5
- 3.0
- Grupo LCLP-DLog
- (in symbol SD-80259-1021) B9; B4; B12; B1

### Library data of the parts
C15 = C0402-10µF-6.3V-X6S: as C3 on sheet Sheet2_nRF54L15; Part Number: C0402-10µF-6.3V-X6S; PartId: 100200478; Component Class: Capacitors; Author: getr; Manufacturer Part Number: N.A.; ComponentLink1URL: N.A.; ComponentLink1Description: Datasheet; ComponentLink2URL: N.A.; ComponentLink2Description: Supplier link; HelpURL: N.A.; LatestRevisionDate: 2021-06-25; Published: 2021-06-25; Value: 10µF; Note: 6.3V; Supplier 1: N.A.; Supplier Part Number 1: N.A.; Supplier 2: N.A.; Supplier Part Number 2: N.A.; Artikkelnr Noca: N.A.; Part number IPS: N.A.; Part number Norautron: N.A.
C16 = C0201-100n-10V-X7R: as C4 on sheet Sheet2_nRF54L15; Part Number: C0201-100n-10V-X7R; Manufacturer Part Number: N.A.; LatestRevisionDate: 2021-04-12; Published: 2021-04-12; Value: 100nF; Artikkelnr Noca: N.A.; Part number IPS: N.A.; ComponentLink1URL: N.A.; ComponentLink1Description: Datasheet; ComponentLink2URL: N.A.; ComponentLink2Description: Supplier link; HelpURL: N.A.; Supplier 1: N.A.; Supplier Part Number 1: N.A.; Supplier 2: N.A.; Supplier Part Number 2: N.A.; Component Class: Capacitors; Author: getr; Part number Norautron: N.A.; PartId: 100200469
C26 C28 C29 = C0603-10µ: Capacitor, X5R, ±20%; Manufacturer: N.A.; Part number IPS: 00000007785; Part number NEMS: 100200275; Value: 10µF; Note: 6.3V; Artikkelnr Noca: 20039234; Pad Count: 2; Component Status: Active; Part Number: C0603-10µ; Manufacturer Part Number: N.A.; ComponentLink1URL: N.A.; ComponentLink1Description: Datasheet; ComponentLink2URL: N.A.; ComponentLink2Description: Supplier link; HelpURL: N.A.; Footprint Doc: 0603; LatestRevisionDate: 2011-01-17; Published: 2011-01-17; Supplier 1: N.A.; Supplier Part Number 1: N.A.; Supplier 2: N.A.; Supplier Part Number 2: N.A.; Component Class: Capacitors; PartId: 100200275; Author: rsk; Part number Norautron: N.A.
C59 = C0603-10n-100V-X7R: Capacitor, X7R, ±10%, 100V; Manufacturer: Murata; Manufacturer Part Number: GCM188R72A103KA37D; Part number NEMS: 100200349; Component Status: Active; Pad Count: 2; Artikkelnr Noca: N.A.; Part Number: C0603-10n-100V-X7R; PartId: 100200349; Component Class: Capacitors; Author: rsk; ComponentLink1URL: N.A.; ComponentLink1Description: Datasheet; ComponentLink2URL: N.A.; ComponentLink2Description: Supplier link; HelpURL: http://psearch.en.murata.com/capacitor/product/GCM188R72A103KA37%23.pdf; LatestRevisionDate: 2017-08-22; Published: 2017-08-22; Footprint Doc: 0603; Value: 10nF; Note: 100V; Supplier 1: Digi-Key; Supplier Part Number 1: 490-4781-1-ND; Supplier 2: N.A.; Supplier Part Number 2: N.A.; Part number IPS: N.A.; Part number Norautron: N.A.
J2 = CMP-002-00071-3: Micro SD Card Connector, 9 Positions, Connector and Ejector, Push In, Auto Eject Out, Surface Mount, 1.8 mm Height Above Board, Gold Flash; MF: Same Sky; Pins: 13; Design Item ID: MSD-4-A; Case/Package: None; Source: MSD-4-A.SchLib; Component Type: Standard; Check_prices: https://www.snapeda.com/parts/MSD-4-A/Same+Sky/view-part/?ref=eda; Value: *; SnapEDA_Link: https://www.snapeda.com/parts/MSD-4-A/Same+Sky/view-part/?ref=snap; MP: MSD-4-A
J4 = SD-80259-1021: USB-C Receptacle, 16 Pin, USB 2.0; Manufacturer: Bellweather Electronic Corp.; Part number NEMS: 100500830; Component Status: Active; Pad Count: 16; Note: N.A.; System: Connector; Part Number: SD-80259-1021; PartId: 100500830; Component Class: Connectors; Author: getr; Manufacturer Part Number: SD-80259-1021; ComponentLink1URL: \\hizz\pro\app9717\Datasheet\connectors\Bellwether\SD-80259-001_C.pdf; ComponentLink1Description: Datasheet; ComponentLink2URL: N.A.; ComponentLink2Description: Supplier link; HelpURL: N.A.; LatestRevisionDate: 2023-10-30; Published: 2023-10-30; Footprint Doc: SD-80259-001; Value: USB-C 2.0; Supplier 1: Cabcon; Supplier Part Number 1: SD-80259-1021; Supplier 2: N.A.; Supplier Part Number 2: N.A.; Artikkelnr Noca: N.A.; Part number IPS: N.A.; Part number Norautron: N.A.
J5 = CMP-002-00090-1: Terminal Block, 5MM Pitch, Horizontal, Pressure Clamp, 30-12 AWG, 2 Pins, Gry; Mounting Technology: Through Hole; Min Operating Temperature: -30°C; Pins: 2; Max Operating Temperature: 120°C
J7 = CMP-002-00099-1: Connector Header Surface Mount, Right Angle 3 position 0.059 (1.50mm); MF: JST Sales; Source: S3B-ZR-SM4A-TF.SchLib; Value: *; SnapEDA_Link: https://www.snapeda.com/parts/S3B-ZR-SM4A-TF/JST/view-part/?ref=snap; Pins: 3; MP: S3B-ZR-SM4A-TF; Design Item ID: S3B-ZR-SM4A-TF; Case/Package: None; Component Type: Standard; Check_prices: https://www.snapeda.com/parts/S3B-ZR-SM4A-TF/JST/view-part/?ref=eda
J9 = CMP-002-00100-2: Connector Header Surface Mount, Right Angle 2 position 0.059 (1.50mm); MF: JST Sales; SnapEDA_Link: https://www.snapeda.com/parts/S2B-ZR-SM4A-TF/JST/view-part/?ref=snap; Design Item ID: S2B-ZR-SM4A-TF; MP: S2B-ZR-SM4A-TF; Source: S2B-ZR-SM4A-TF.SchLib; Case/Package: None; Pins: 2; Component Type: Standard; Value: *; Check_prices: https://www.snapeda.com/parts/S2B-ZR-SM4A-TF/JST/view-part/?ref=eda
JP1 = SHUNT JUMPER 2.54mm Black Vertical: Shunt Jumper 2.54mm Black, open top; Manufacturer: Samtec; Manufacturer Part Number: SNT-100-BK-T; Part number NEMS: 100500728; Component Status: Active; Pad Count: 2; Note: N.A.; Part Number: SHUNT JUMPER 2.54mm Black Vertical; PartId: 100500752; Component Class: Connectors; Author: masi; ComponentLink1URL: N.A.; ComponentLink1Description: Datasheet; ComponentLink2URL: N.A.; ComponentLink2Description: Supplier link; HelpURL: N.A.; LatestRevisionDate: 2022-07-01; Published: 2022-07-01; Footprint Doc: SHUNT JUMPER 2.54mm; Value: Shunt 2.54mm; Supplier 1: N.A.; Supplier Part Number 1: N.A.; Supplier 2: N.A.; Supplier Part Number 2: N.A.; Artikkelnr Noca: N.A.; Part number IPS: N.A.; Part number Norautron: N.A.
P1 = Pin Header 2x5 SMD, 1.27mm, KS: Pin Header 2x5, 1.27mm (50mil), SMD, Keying Shroud; Manufacturer: WCON; Manufacturer Part Number: 3132-10MS0BK00R5; Part number NEMS: 100500261; Note: (Replaced 3132-10MS0BK00R1); Artikkelnr Noca: N.A.; Pad Count: 10; Component Status: Active; System: Connector; Part Number: Pin Header 2x5 SMD, 1.27mm, KS; Footprint Doc: HDR_2x5-SMD-1.27mm; LatestRevisionDate: 2024-02-02; Published: 2016-01-22; Value: Pin Header 2x5, 1.27mm; Part number IPS: N.A.; ComponentLink1URL: N.A.; ComponentLink1Description: Datasheet; ComponentLink2URL: N.A.; ComponentLink2Description: Supplier link; HelpURL: \\hizz\pro\app9717\Datasheet\connectors\W-CON\3132-XXMXXBK00XX.pdf; Supplier 1: Cabcon; Supplier Part Number 1: 3132-10MS0BK00R5; Supplier 2: N.A.; Supplier Part Number 2: N.A.; Component Class: Connectors; PartId: 100500261; Author: rsk; Part number Norautron: N.A.
P2 = Pin List 1x3 SMD: Pin List 1x3, 2.54mm (100mil), SMD; Manufacturer: W-CON; Manufacturer Part Number: 1125-1103S0M116CR02; Part number Norautron: 26470016; Part number NEMS: 100500306; Component Status: Active; Pad Count: 3; Note: N.A.; System: Connector; Part Number: Pin List 1x3 SMD; PartId: 100500306; Component Class: Connectors; Author: rsk; ComponentLink1URL: N.A.; ComponentLink1Description: Datasheet; ComponentLink2URL: N.A.; ComponentLink2Description: Supplier link; HelpURL: N.A.; LatestRevisionDate: 2021-09-24; Published: 2013-10-21; Footprint Doc: LIST_1x3_SMD; Value: Pin List 1x3; Supplier 1: Cabcon; Supplier Part Number 1: 1125-1103S0M116CR02; Supplier 2: Samtec; Supplier Part Number 2: TSM-103-01-L-SV-P-TR; Artikkelnr Noca: N.A.; Part number IPS: N.A.
P3 = CMP-002-00096-1: Socket 1x6, 2.54mm (100mil), Right Angled, SMD; Manufacturer Part Number: 2185-106ZS0CYNRX; Part number NEMS: 100500782; Manufacturer: W-CON; Value: Socket 1x6, Angled; Artikkelnr Noca: N.A.; System: Connector; Pad Count: 6; Component Status: Active; Component Class: Connectors; Author: eisk; ComponentLink2Description: Supplier link; Note: N.A.; Design Item ID: Socket Ang 1x6 SMD; Part Number: Socket Ang 1x6 SMD; ComponentLink1Description: Datasheet; Source: pca10152.SCHLIB; PartId: 100500782; HelpURL: N.A.; ComponentLink1URL: \\hizz\pro\app9717\Datasheet\connectors\W-CON\2185-1XXZG0CYNXX.pdf; ComponentLink2URL: N.A.; Footprint Doc: SOCKET_1x6_SMD-ANG; Published: 2022-01-25; LatestRevisionDate: 2022-02-09; Part number IPS: N.A.; Part number Norautron: N.A.
R4-R7 = R0201-10k: Resistor, ±1%, 0.05W; Manufacturer: N.A.; Part number IPS: 00000001255; Part number Norautron: 26107101; Part number NEMS: 100100065; Pad Count: 2; Note: Chip Res 1%; Component Status: Active; Part Number: R0201-10k; PartId: 100100065; Component Class: Resistors; Author: rsk; Manufacturer Part Number: N.A.; ComponentLink1URL: N.A.; ComponentLink1Description: Datasheet; ComponentLink2URL: N.A.; ComponentLink2Description: Supplier link; HelpURL: N.A.; Footprint Doc: 0201; LatestRevisionDate: 2014-11-13; Published: 2014-11-13; Value: 10k; Supplier 1: N.A.; Supplier Part Number 1: N.A.; Supplier 2: N.A.; Supplier Part Number 2: N.A.; Artikkelnr Noca: N.A.
R11 = R0402-N.C.: Not mounted; Manufacturer: N.A.; Part number NEMS: 100100281; Component Status: Active; Pad Count: 2; Value: DNM; Note: Chip Res; Assembly: Not mounted; Part Number: R0402-N.C.; PartId: 100100281; Component Class: Resistors; Author: rsk; Manufacturer Part Number: N.A.; ComponentLink1URL: N.A.; ComponentLink1Description: Datasheet; ComponentLink2URL: N.A.; ComponentLink2Description: Supplier link; HelpURL: N.A.; LatestRevisionDate: 2009-05-08; Published: 2009-05-08; Footprint Doc: 0402; Supplier 1: N.A.; Supplier Part Number 1: N.A.; Supplier 2: N.A.; Supplier Part Number 2: N.A.; Artikkelnr Noca: N.A.; Part number IPS: N.A.; Part number Norautron: N.A.
R12 = R0201-10k: Resistor, ±1%, 0.05W; Manufacturer: N.A.; Part number IPS: 00000001255; Part number Norautron: 26107101; Part number NEMS: 100100065; Pad Count: 2; Value: 10k; Note: Chip Res 1%; Component Status: Active; Part Number: R0201-10k; PartId: 100100065; Component Class: Resistors; Author: rsk; Manufacturer Part Number: N.A.; ComponentLink1URL: N.A.; ComponentLink1Description: Datasheet; ComponentLink2URL: N.A.; ComponentLink2Description: Supplier link; HelpURL: N.A.; Footprint Doc: 0201; LatestRevisionDate: 2014-11-13; Published: 2014-11-13; Supplier 1: N.A.; Supplier Part Number 1: N.A.; Supplier 2: N.A.; Supplier Part Number 2: N.A.; Artikkelnr Noca: N.A.
R13 = R0402-N.C.: Not mounted; Manufacturer: N.A.; Part number NEMS: 100100281; Component Status: Active; Pad Count: 2; Note: Chip Res; Assembly: Not mounted; Part Number: R0402-N.C.; PartId: 100100281; Component Class: Resistors; Author: rsk; Manufacturer Part Number: N.A.; ComponentLink1URL: N.A.; ComponentLink1Description: Datasheet; ComponentLink2URL: N.A.; ComponentLink2Description: Supplier link; HelpURL: N.A.; LatestRevisionDate: 2009-05-08; Published: 2009-05-08; Footprint Doc: 0402; Value: DNM; Supplier 1: N.A.; Supplier Part Number 1: N.A.; Supplier 2: N.A.; Supplier Part Number 2: N.A.; Artikkelnr Noca: N.A.; Part number IPS: N.A.; Part number Norautron: N.A.
R16 R17 = R0201-1k0: as R3 on sheet Sheet2_nRF54L15; Part Number: R0201-1k0; PartId: 100100043; Component Class: Resistors; Author: rsk; Manufacturer Part Number: N.A.; ComponentLink1URL: N.A.; ComponentLink1Description: Datasheet; ComponentLink2URL: N.A.; ComponentLink2Description: Supplier link; HelpURL: N.A.; LatestRevisionDate: 2014-11-13; Published: 2014-11-13; Supplier 1: N.A.; Supplier Part Number 1: N.A.; Supplier 2: N.A.; Supplier Part Number 2: N.A.; Artikkelnr Noca: N.A.; Part number Norautron: N.A.
SW1 SW2 = CMP-011-00014-1: Switch Tactile OFF Mom SPST Round Button Gull Wing 50mA 12VDC 100000Cycles 1.77N Surface Mount T/R; Throw Configuration: SPST; Mounting Technology: Surface Mount; Min Operating Temperature: -40°C; Max Operating Temperature: 70°C; Max Current Rating: 50mA

## Nets that join several sheets
GND: Sheet2_nRF54L15 (20 pins), Sheet4_Communications (9 pins), Sheet5_Misc (25 pins)
VDD:nRF: Sheet2_nRF54L15 (10 pins), Sheet4_Communications (C13.2 C14.1 MD1.13), Sheet5_Misc (P1.1 R11.2 R12.2 R13.2)
DIO0_LoRa: Sheet2_nRF54L15 (U1.40), Sheet4_Communications (MD1.14)
nRF54_RESET: Sheet2_nRF54L15 (R3.2), Sheet5_Misc (P1.10 SW1.3)
P0.00: Sheet2_nRF54L15 (U1.23), Sheet5_Misc (P3.4)
P0.01: Sheet2_nRF54L15 (U1.24), Sheet5_Misc (P3.3)
P0.02: Sheet2_nRF54L15 (U1.27), Sheet5_Misc (P3.6)
P0.03: Sheet2_nRF54L15 (U1.28), Sheet5_Misc (P3.5)
P0.04: Sheet2_nRF54L15 (U1.29), Sheet5_Misc (C26.2 R16.1)
P1.06: Sheet2_nRF54L15 (U1.7), Sheet5_Misc (C29.2 R17.1)
P1.07: Sheet2_nRF54L15 (U1.8), Sheet4_Communications (MD1.5)
P1.08: Sheet2_nRF54L15 (U1.9), Sheet4_Communications (MD1.3), Sheet5_Misc (J2.3 R6.2)
P1.09: Sheet2_nRF54L15 (U1.37), Sheet4_Communications (MD1.4), Sheet5_Misc (J2.5 R7.2)
P1.10: Sheet2_nRF54L15 (U1.38), Sheet4_Communications (MD1.6)
P1.11: Sheet2_nRF54L15 (U1.39), Sheet4_Communications (MD1.2), Sheet5_Misc (J2.7 R5.2)
P1.13: Sheet2_nRF54L15 (U1.41), Sheet5_Misc (C28.2 R13.1 SW2.3)
P1.14: Sheet2_nRF54L15 (U1.42), Sheet5_Misc (J2.2)
P2.07: Sheet2_nRF54L15 (U1.18), Sheet5_Misc (P1.6)
SWDCLK: Sheet2_nRF54L15 (U1.26), Sheet5_Misc (P1.4)
SWDIO: Sheet2_nRF54L15 (U1.25), Sheet5_Misc (P1.2)